# Altium project openbook.PrjPCB (part 3 of 4)

## Sheet p07_ddr3_memory.SchDoc
size 386 x 246 mm
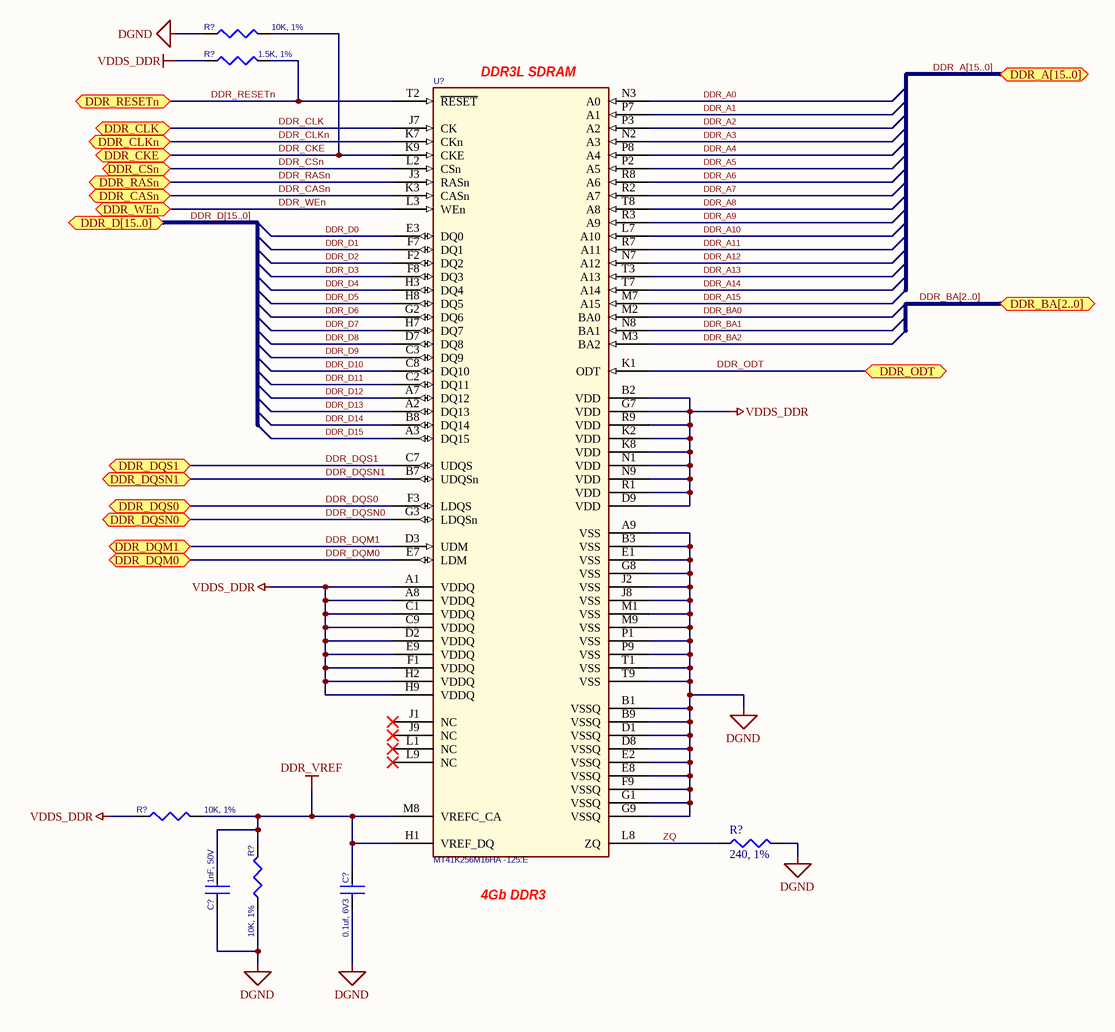
[diagram p7: p07_ddr3_memory.SchDoc]

### Parts
(Parts that share a designator on the sheet are numbered #1, #2 ... from top to bottom, then left to right.)
C?#108  1nF, 50V  [402]
C?#109  0.1uf, 6V3  [402]
R?#78  10K, 1%  [402]
R?#79  1.5K, 1%  [402]
R?#80  10K, 1%  [402]
R?#81  240, 1%  [402]
R?#82  10K, 1%  [402]
U?#16  MT41K256M16HA -125:E  [BGA96_T9_P8_9X14]

### Ports
DDR_A[15..0], DDR_BA[2..0], DDR_CASn, DDR_CKE, DDR_CLK, DDR_CLKn, DDR_CSn, DDR_D[15..0], DDR_DQM0, DDR_DQM1, DDR_DQS0, DDR_DQS1, DDR_DQSN0, DDR_DQSN1, DDR_ODT, DDR_RASn, DDR_RESETn, DDR_WEn

### Nets
DDR_VREF: C?#108.1 C?#109.1 R?#80.2 R?#82.2 U?#16.H1(VREF_DQ) U?#16.M8(VREFC_CA)
DGND: C?#108.2 C?#109.2 R?#78.1 R?#81.2 R?#82.1 U?#16.A9(VSS) U?#16.B1(VSSQ) U?#16.B3(VSS) U?#16.B9(VSSQ) U?#16.D1(VSSQ) U?#16.D8(VSSQ) U?#16.E1(VSS) U?#16.E2(VSSQ) U?#16.E8(VSSQ) U?#16.F9(VSSQ) U?#16.G1(VSSQ) U?#16.G8(VSS) U?#16.G9(VSSQ) U?#16.J2(VSS) U?#16.J8(VSS) U?#16.M1(VSS) U?#16.M9(VSS) U?#16.P1(VSS) U?#16.P9(VSS) U?#16.T1(VSS) U?#16.T9(VSS)
VDDS_DDR: R?#79.1 R?#80.1 U?#16.A1(VDDQ) U?#16.A8(VDDQ) U?#16.B2(VDD) U?#16.C1(VDDQ) U?#16.C9(VDDQ) U?#16.D2(VDDQ) U?#16.D9(VDD) U?#16.E9(VDDQ) U?#16.F1(VDDQ) U?#16.G7(VDD) U?#16.H2(VDDQ) U?#16.H9(VDDQ) U?#16.K2(VDD) U?#16.K8(VDD) U?#16.N1(VDD) U?#16.N9(VDD) U?#16.R1(VDD) U?#16.R9(VDD)
DDR_A0: U?#16.N3(A0)
DDR_A1: U?#16.P7(A1)
DDR_A2: U?#16.P3(A2)
DDR_A3: U?#16.N2(A3)
DDR_A4: U?#16.P8(A4)
DDR_A5: U?#16.P2(A5)
DDR_A6: U?#16.R8(A6)
DDR_A7: U?#16.R2(A7)
DDR_A8: U?#16.T8(A8)
DDR_A9: U?#16.R3(A9)
DDR_A10: U?#16.L7(A10)
DDR_A11: U?#16.R7(A11)
DDR_A12: U?#16.N7(A12)
DDR_A13: U?#16.T3(A13)
DDR_A14: U?#16.T7(A14)
DDR_A15: U?#16.M7(A15)
DDR_BA0: U?#16.M2(BA0)
DDR_BA1: U?#16.N8(BA1)
DDR_BA2: U?#16.M3(BA2)
DDR_CASn: U?#16.K3(CASn) ; port DDR_CASn
DDR_CKE: R?#78.2 U?#16.K9(CKE) ; port DDR_CKE
DDR_CLK: U?#16.J7(CK) ; port DDR_CLK
DDR_CLKn: U?#16.K7(CKn) ; port DDR_CLKn
DDR_CSn: U?#16.L2(CSn) ; port DDR_CSn
DDR_D0: U?#16.E3(DQ0)
DDR_D1: U?#16.F7(DQ1)
DDR_D2: U?#16.F2(DQ2)
DDR_D3: U?#16.F8(DQ3)
DDR_D4: U?#16.H3(DQ4)
DDR_D5: U?#16.H8(DQ5)
DDR_D6: U?#16.G2(DQ6)
DDR_D7: U?#16.H7(DQ7)
DDR_D8: U?#16.D7(DQ8)
DDR_D9: U?#16.C3(DQ9)
DDR_D10: U?#16.C8(DQ10)
DDR_D11: U?#16.C2(DQ11)
DDR_D12: U?#16.A7(DQ12)
DDR_D13: U?#16.A2(DQ13)
DDR_D14: U?#16.B8(DQ14)
DDR_D15: U?#16.A3(DQ15)
DDR_DQM0: U?#16.E7(LDM) ; port DDR_DQM0
DDR_DQM1: U?#16.D3(UDM) ; port DDR_DQM1
DDR_DQS0: U?#16.F3(LDQS) ; port DDR_DQS0
DDR_DQS1: U?#16.C7(UDQS) ; port DDR_DQS1
DDR_DQSN0: U?#16.G3(LDQSn) ; port DDR_DQSN0
DDR_DQSN1: U?#16.B7(UDQSn) ; port DDR_DQSN1
DDR_ODT: U?#16.K1(ODT) ; port DDR_ODT
DDR_RASn: U?#16.J3(RASn) ; port DDR_RASn
DDR_RESETn: R?#79.2 U?#16.T2(~{RESET}) ; port DDR_RESETn
DDR_WEn: U?#16.L3(WEn) ; port DDR_WEn
ZQ: R?#81.1 U?#16.L8(ZQ)

Not connected (* = marked no-connect by the designer): U?#16 J1(NC)* J9(NC)* L1(NC)* L9(NC)*

### Buses and harness runs
bus DDR_A[15..0] = port DDR_A[15..0]
bus DDR_BA[2..0] = port DDR_BA[2..0]
bus DDR_D[15..0] = port DDR_D[15..0]

### Notes on the sheet
- (near U?#16) DDR3L SDRAM
- (near U?#16) 4Gb DDR3

### Library data of the parts
C?#108 = CAP_0.001_X7R_50V_5%_0402: CAP CER 1000PF 16V 10% X7R 0402; Manufacturer: Yageo; Manufacturer Part Number: CC0402KRX7R7BB102; Supplier 1: Digi-Key; Supplier Part Number 1: 311-1352-6-ND; RoHS: RoHS Compliant; Category: Capacitors; Stock 1: 394472; Pricing 1: 1=0.1, 10=0.012, 25=0.0088, 100=0.0057, 250=0.00464, 500=0.00396, 1000=0.00309, 2500=0.00278, 5000=0.00258 (USD); Capacitance: 1000pF; Voltage - Rated: 16V; Tolerance: ±10%; Temperature Coefficient: X7R; Mounting Type: Surface Mount, MLCC; Operating Temperature: -55°C ~ 125°C; Applications: General Purpose; Ratings: -; Package / Case: 0402 (1005 Metric); Size / Dimension: 0.039" L x 0.020" W (1.00mm x 0.50mm); Height - Seated (Max): -; Thickness (Max): 0.022" (0.55mm); Lead Spacing: -; Features: -; Packaging: Digi-Reel®; Lead Style: -; ComponentLink1URL: http://www.yageo.com/documents/recent/UPY-GPHC_X7R_6.3V-to-50V_8.pdf; ComponentLink1Description: http://www.yageo.com/documents/recent/UPY-GPHC_X7R_6.3V-to-50V_8.pdf
C?#109 = CAP_0.1uF_X7R_16V_10% 0402: CAP CER 0.1UF 6.3V 10% X5R 0402; Manufacturer: TDK Corporation; Manufacturer Part Number: C1005X5R0J104K050BA; Capacitance: 0.1µF; Applications: General Purpose; Category: Capacitors; ComponentLink1Description: http://www.kemet.com/datasheets&C0402C104K4RACTU; ComponentLink1URL: http://www.kemet.com/datasheets&C0402C104K4RACTU; Features: -; Height - Seated (Max): -; Lead Spacing: -; Lead Style: -; Mounting Type: Surface Mount, MLCC; Operating Temperature: -55°C ~ 85°C; Package / Case: 0402 (1005 Metric); Packaging: Digi-Reel®; Pricing 1: 1=0.1, 10=0.026, 100=0.0121, 250=0.00992, 500=0.00848, 1000=0.0066, 5000=0.0055 (USD); Ratings: -; RoHS: RoHS Compliant; Size / Dimension: 0.039" L x 0.020" W (1.00mm x 0.50mm); Stock 1: 127604; Supplier 1: Digi-Key; Supplier Part Number 1: 445-1266-6-ND; Temperature Coefficient: X5R; Thickness (Max): 0.022" (0.55mm); Tolerance: ±10%; Voltage - Rated: 6.3V
R?#78 R?#80 R?#82 = RES_10K_1/16W_1%_0402: RES 10K OHM 1/16W 5% 0402 SMD; Manufacturer: Rohm Semiconductor; Manufacturer Part Number: MCR01MZPJ103; Power (Watts): 0.063W, 1/16W; Temperature Coefficient: ±200ppm/°C; Supplier 1: Digi-Key; Supplier Part Number 1: RHM10KJDKR-ND; RoHS: RoHS Compliant; Category: Resistors; Stock 1: 110842; Pricing 1: 1=0.1, 10=0.019, 25=0.014, 100=0.0078, 250=0.00596, 500=0.00476, 1000=0.0035, 5000=0.00251 (USD); Resistance (Ohms): 10k; Composition: Thick Film; Features: Automotive AEC-Q200 Qualified; Tolerance: ±5%; Package / Case: 0402 (1005 Metric); Supplier Device Package: 0402 (1005 Metric); Size / Dimension: 0.039" L x 0.020" W (1.00mm x 0.50mm); Height: 0.016" (0.40mm); Number of Terminations: 2; Packaging: Digi-Reel®; ComponentLink1URL: http://rohmfs.rohm.com/en/products/databook/datasheet/passive/resistor/chip_resistor/mcr_a.pdf; ComponentLink1Description: http://rohmfs.rohm.com/en/products/databook/datasheet/passive/resistor/chip_resistor/mcr_a.pdf
R?#79 = RES_1.5K_1/16W_5%_0402: RES 1.50K OHM 1/16W 1% 0402 SMD; Manufacturer: Yageo; Manufacturer Part Number: RC0402FR-071K5L; Power (Watts): 0.063W, 1/16W; Temperature Coefficient: ±100ppm/°C; Supplier 1: Digi-Key; Supplier Part Number 1: 311-1.50KLRDKR-ND; RoHS: RoHS Compliant; Category: Resistors; Stock 1: 465266; Pricing 1: 1=0.1, 10=0.014, 25=0.0104, 100=0.0063, 250=0.0054, 500=0.00382, 1000=0.0027, 2500=0.00234, 5000=0.00203 (USD); Resistance (Ohms): 1.5k; Composition: Thick Film; Features: -; Tolerance: ±1%; Package / Case: 0402 (1005 Metric); Supplier Device Package: 0402; Size / Dimension: 0.039" L x 0.020" W (1.00mm x 0.50mm); Height: 0.016" (0.40mm); Number of Terminations: 2; Packaging: Digi-Reel®; ComponentLink1URL: http://www.yageo.com/documents/recent/PYu-RC0402_51_RoHS_L_6.pdf; ComponentLink1Description: http://www.yageo.com/documents/recent/PYu-RC0402_51_RoHS_L_6.pdf
R?#81 = RES_240_1/10W_1%_0402: RES 240 OHM 1/10W 1% 0402; Manufacturer: Yageo; Manufacturer Part Number: RC0402FR-07240RL; Resistance (Ohms): 240; Power (Watts): 0.063W, 1/16W; Temperature Coefficient: ±100ppm/°C; Supplier 1: Digi-Key; RoHS: RoHS Compliant; Category: Resistors; Stock 1: 80881; Pricing 1: 1=0.1, 10=0.014, 25=0.0104, 100=0.0063, 250=0.0054, 500=0.00382, 1000=0.0027, 2500=0.00234, 5000=0.00203 (USD); Packaging: Cut Tape (CT); Tolerance: ±1%; Composition: Thick Film; Features: -; Package / Case: 0402 (1005 Metric); Supplier Device Package: 0402; Size / Dimension: 0.039" L x 0.020" W (1.00mm x 0.50mm); Height: 0.016" (0.40mm); Number of Terminations: 2; ComponentLink1URL: http://www.yageo.com/documents/recent/PYu-RC0402_51_RoHS_L_6.pdf; ComponentLink1Description: http://www.yageo.com/documents/recent/PYu-RC0402_51_RoHS_L_6.pdf; Supplier Part Number 1: 311-240LRCT-ND
U?#16 = MT41K256M16HA: DDR2 SDRAM 2Gb (256Mx8); Manufacturer: Micron Technology; Lead Time: 0 weeks; Peak Solder Temperature: 260 deg C; Supplier 1: Arrow; Supplier Part Number 1: 52128708S9959891N2406; Manufacturer Part Number: MT41K256M16HA-125:E; RoHS: CHINA ROHS: Compliant / EU ROHS: Compliant; Stock 1: 0; Pricing 1: 0=10.09 (USD); Package Quantity: 1; Termination Finish: Sn/Ag/Cu; China ROHS Lead (X -> above / O -> below threshold): O; China ROHS Mercury (X -> above / O -> below threshold): O; China ROHS Cadmium (X -> above / O -> below threshold): O; China ROHS Hex Chromium (X -> above / O -> below threshold): O; China ROHS PBB (X -> above / O -> below threshold): O; China ROHS PBDE (X -> above / O -> below threshold): O; EU_ROHS_PROD_EXEMPTION_BY_SUPP: N/R; ComponentLink1URL: http://components.arrow.com/partservice/dataview/altium/52128708S9959891N2406?apiKey=aa438727d59eed98c4bed826d8d949c84cb5e685b92bf87346a0226bd2658797; ComponentLink1Description: http://components.arrow.com/partservice/dataview/altium/52128708S9959891N2406?apiKey=aa438727d59eed98c4bed826d8d949c84cb5e685b92bf87346a0226bd2658797

## Sheet p08_eMMC.SchDoc
size 386 x 246 mm
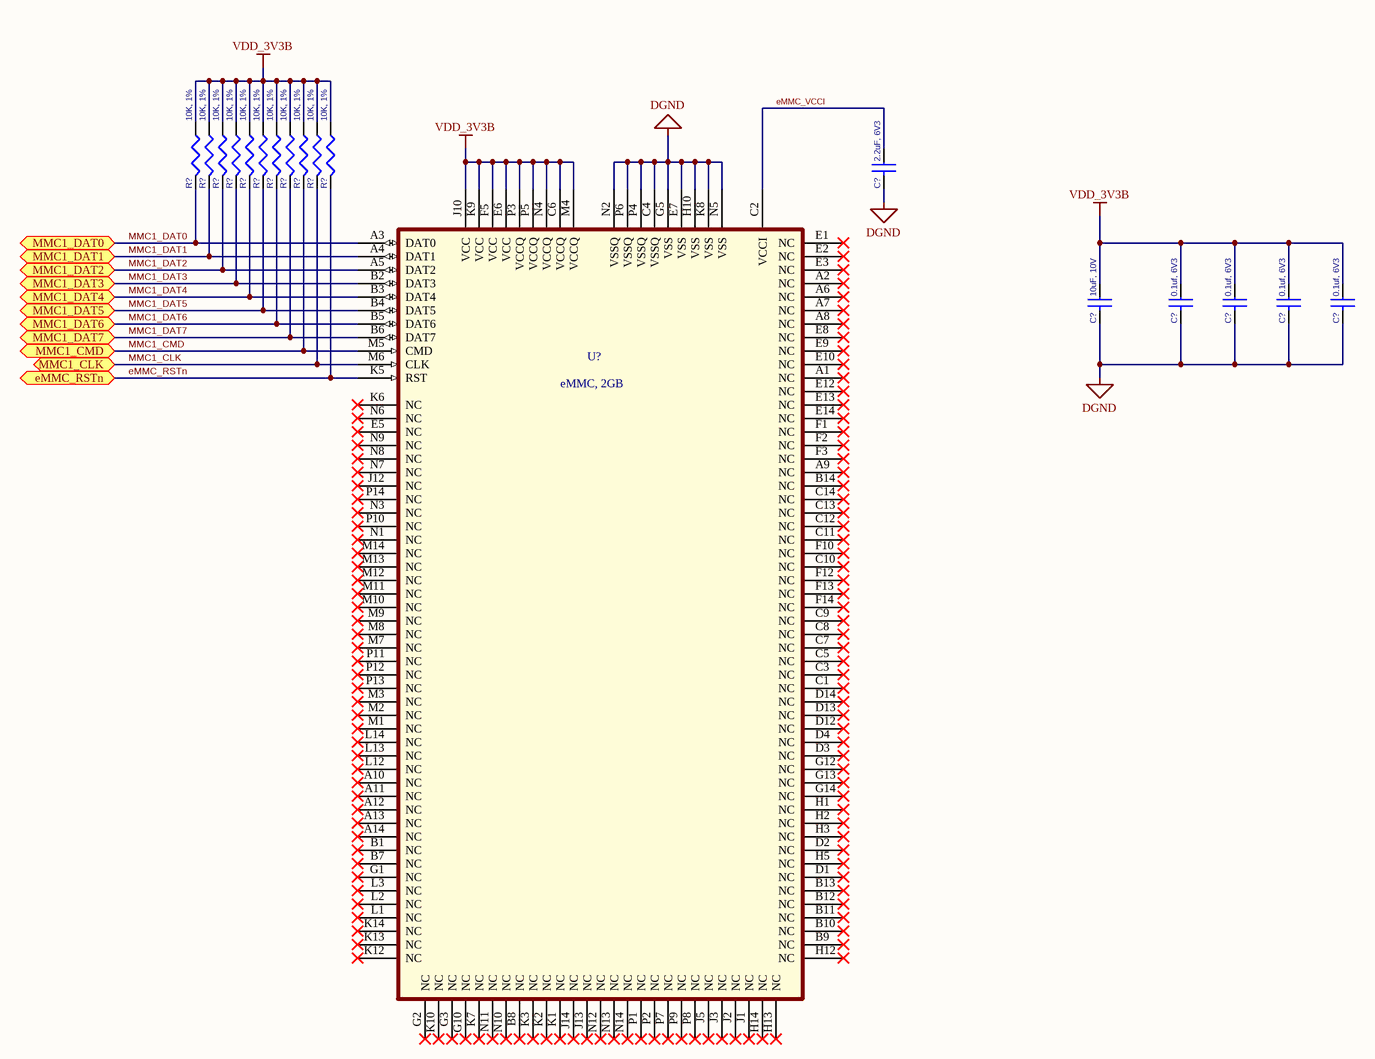
[diagram p8: p08_eMMC.SchDoc]

### Parts
(Parts that share a designator on the sheet are numbered #1, #2 ... from top to bottom, then left to right.)
C?#110  2.2uF, 6V3  [402]
C?#111  10uF, 10V  [805]
C?#112  0.1uf, 6V3  [402]
C?#113  0.1uf, 6V3  [402]
C?#114  0.1uf, 6V3  [402]
C?#115  0.1uf, 6V3  [402]
R?#83  10K, 1%  [402]
R?#84  10K, 1%  [402]
R?#85  10K, 1%  [402]
R?#86  10K, 1%  [402]
R?#87  10K, 1%  [402]
R?#88  10K, 1%  [402]
R?#89  10K, 1%  [402]
R?#90  10K, 1%  [402]
R?#91  10K, 1%  [402]
R?#92  10K, 1%  [402]
R?#93  10K, 1%  [402]
U?#17  eMMC, 2GB  [BGA153_P14_P5_11P5X13]

### Ports
eMMC_RSTn, MMC1_CLK, MMC1_CMD, MMC1_DAT0, MMC1_DAT1, MMC1_DAT2, MMC1_DAT3, MMC1_DAT4, MMC1_DAT5, MMC1_DAT6, MMC1_DAT7

### Nets
DGND: C?#110.2 C?#111.2 C?#112.2 C?#113.2 C?#114.2 C?#115.2 U?#17.C4(VSSQ) U?#17.E7(VSS) U?#17.G5(VSS) U?#17.H10(VSS) U?#17.K8(VSS) U?#17.N2(VSSQ) U?#17.N5(VSS) U?#17.P4(VSSQ) U?#17.P6(VSSQ)
VDD_3V3B: C?#111.1 C?#112.1 C?#113.1 C?#114.1 C?#115.1 R?#83.1 R?#84.1 R?#85.1 R?#86.1 R?#87.1 R?#88.1 R?#89.1 R?#90.1 R?#91.1 R?#92.1 R?#93.1 U?#17.C6(VCCQ) U?#17.E6(VCC) U?#17.F5(VCC) U?#17.J10(VCC) U?#17.K9(VCC) U?#17.M4(VCCQ) U?#17.N4(VCCQ) U?#17.P3(VCCQ) U?#17.P5(VCCQ)
eMMC_RSTn: R?#93.2 U?#17.K5(RST) ; port eMMC_RSTn
eMMC_VCCI: C?#110.1 U?#17.C2(VCCI)
MMC1_CLK: R?#92.2 U?#17.M6(CLK) ; port MMC1_CLK
MMC1_CMD: R?#91.2 U?#17.M5(CMD) ; port MMC1_CMD
MMC1_DAT0: R?#83.2 U?#17.A3(DAT0) ; port MMC1_DAT0
MMC1_DAT1: R?#84.2 U?#17.A4(DAT1) ; port MMC1_DAT1  [project net EHRPWM1A]
MMC1_DAT2: R?#85.2 U?#17.A5(DAT2) ; port MMC1_DAT2  [project net EHRPWM1B]
MMC1_DAT3: R?#86.2 U?#17.B2(DAT3) ; port MMC1_DAT3
MMC1_DAT4: R?#87.2 U?#17.B3(DAT4) ; port MMC1_DAT4
MMC1_DAT5: R?#88.2 U?#17.B4(DAT5) ; port MMC1_DAT5
MMC1_DAT6: R?#89.2 U?#17.B5(DAT6) ; port MMC1_DAT6
MMC1_DAT7: R?#90.2 U?#17.B6(DAT7) ; port MMC1_DAT7

Not connected (* = marked no-connect by the designer): U?#17 A1(NC)* A2(NC)* A6(NC)* A7(NC)* A8(NC)* A9(NC)* A10(NC)* A11(NC)* A12(NC)* A13(NC)* A14(NC)* B1(NC)* B7(NC)* B8(NC)* B9(NC)* B10(NC)* B11(NC)* B12(NC)* B13(NC)* B14(NC)* C1(NC)* C3(NC)* C5(NC)* C7(NC)* C8(NC)* C9(NC)* C10(NC)* C11(NC)* C12(NC)* C13(NC)* C14(NC)* D1(NC)* D2(NC)* D3(NC)* D4(NC)* D12(NC)* D13(NC)* D14(NC)* E1(NC)* E2(NC)* E3(NC)* E5(NC)* E8(NC)* E9(NC)* E10(NC)* E12(NC)* E13(NC)* E14(NC)* F1(NC)* F2(NC)* F3(NC)* F10(NC)* F12(NC)* F13(NC)* F14(NC)* G1(NC)* G2(NC)* G3(NC)* G10(NC)* G12(NC)* G13(NC)* G14(NC)* H1(NC)* H2(NC)* H3(NC)* H5(NC)* H12(NC)* H13(NC)* H14(NC)* J1(NC)* J2(NC)* J3(NC)* J5(NC)* J12(NC)* J13(NC)* J14(NC)* K1(NC)* K2(NC)* K3(NC)* K6(NC)* K7(NC)* K10(NC)* K12(NC)* K13(NC)* K14(NC)* L1(NC)* L2(NC)* L3(NC)* L12(NC)* L13(NC)* L14(NC)* M1(NC)* M2(NC)* M3(NC)* M7(NC)* M8(NC)* M9(NC)* M10(NC)* M11(NC)* M12(NC)* M13(NC)* M14(NC)* N1(NC)* N3(NC)* N6(NC)* N7(NC)* N8(NC)* N9(NC)* N10(NC)* N11(NC)* N12(NC)* N13(NC)* N14(NC)* P1(NC)* P2(NC)* P7(NC)* P8(NC)* P9(NC)* P10(NC)* P11(NC)* P12(NC)* P13(NC)* P14(NC)*

### Library data of the parts
C?#110 = CAP_2.2uF_X5R_6.3V_10%_0402: CAP CER 2.2UF 6.3V 10% X5R 0402; Manufacturer: TDK Corporation; Manufacturer Part Number: C1005X5R0J225K050BC; Capacitance: 2.2µF; Supplier 1: Digi-Key; Supplier Part Number 1: 445-6847-6-ND; RoHS: RoHS Compliant; Category: Capacitors; Stock 1: 47221; Pricing 1: 1=0.24, 10=0.2, 100=0.1, 250=0.075, 500=0.06626, 1000=0.05875, 5000=0.04875 (USD); Voltage - Rated: 6.3V; Tolerance: ±10%; Temperature Coefficient: X5R; Mounting Type: Surface Mount, MLCC; Operating Temperature: -55°C ~ 85°C; Applications: General Purpose; Ratings: -; Package / Case: 0402 (1005 Metric); Size / Dimension: 0.039" L x 0.020" W (1.00mm x 0.50mm); Height - Seated (Max): -; Thickness (Max): 0.022" (0.55mm); Lead Spacing: -; Features: -; Packaging: Digi-Reel®; Lead Style: -; ComponentLink1URL: http://product.tdk.com/capacitor/mlcc/en/documents/mlcc_commercial_general_en.pdf; ComponentLink1Description: http://product.tdk.com/capacitor/mlcc/en/documents/mlcc_commercial_general_en.pdf
C?#111 = CAP_10uF_Y5V_10V_10%_0805: CAP CER 10UF 10V Y5V 0805; Manufacturer: TDK Corporation; Manufacturer Part Number: C2012Y5V1A106Z; Capacitance: 10µF; Tolerance: -20%, +80%; Temperature Coefficient: Y5V (F); Supplier 1: Digi-Key; Supplier Part Number 1: 445-1371-6-ND; RoHS: RoHS Compliant; Category: Capacitors; Stock 1: 123307; Pricing 1: 1=0.15, 10=0.105, 100=0.0499, 250=0.042, 500=0.03518, 1000=0.02887 (USD); Voltage - Rated: 10V; Mounting Type: Surface Mount, MLCC; Operating Temperature: -30°C ~ 85°C; Applications: General Purpose; Ratings: -; Package / Case: 0805 (2012 Metric); Size / Dimension: 0.079" L x 0.049" W (2.00mm x 1.25mm); Height - Seated (Max): -; Thickness (Max): 0.057" (1.45mm); Lead Spacing: -; Features: -; Packaging: Digi-Reel®; Lead Style: -; ComponentLink1URL: http://media.digikey.com/pdf/Data%20Sheets/TDK%20PDFs/C_Series_GeneralAppl_B11.pdf; ComponentLink1Description: http://media.digikey.com/pdf/Data%20Sheets/TDK%20PDFs/C_Series_GeneralAppl_B11.pdf
C?#112-C?#115 = CAP_0.1uF_X7R_16V_10% 0402: as C?#109 on sheet p07_ddr3_memory; Applications: General Purpose; Category: Capacitors; ComponentLink1Description: http://www.kemet.com/datasheets&C0402C104K4RACTU; ComponentLink1URL: http://www.kemet.com/datasheets&C0402C104K4RACTU; Features: -; Height - Seated (Max): -; Lead Spacing: -; Lead Style: -; Mounting Type: Surface Mount, MLCC; Operating Temperature: -55°C ~ 85°C; Package / Case: 0402 (1005 Metric); Packaging: Digi-Reel®; Pricing 1: 1=0.1, 10=0.026, 100=0.0121, 250=0.00992, 500=0.00848, 1000=0.0066, 5000=0.0055 (USD); Ratings: -; RoHS: RoHS Compliant; Size / Dimension: 0.039" L x 0.020" W (1.00mm x 0.50mm); Stock 1: 127604; Supplier 1: Digi-Key; Supplier Part Number 1: 445-1266-6-ND; Temperature Coefficient: X5R; Thickness (Max): 0.022" (0.55mm); Tolerance: ±10%; Voltage - Rated: 6.3V
R?#83-R?#93 = RES_10K_1/16W_1%_0402: as R?#78 on sheet p07_ddr3_memory; Supplier 1: Digi-Key; Supplier Part Number 1: RHM10KJDKR-ND; RoHS: RoHS Compliant; Category: Resistors; Stock 1: 110842; Pricing 1: 1=0.1, 10=0.019, 25=0.014, 100=0.0078, 250=0.00596, 500=0.00476, 1000=0.0035, 5000=0.00251 (USD); Resistance (Ohms): 10k; Composition: Thick Film; Features: Automotive AEC-Q200 Qualified; Tolerance: ±5%; Package / Case: 0402 (1005 Metric); Supplier Device Package: 0402 (1005 Metric); Size / Dimension: 0.039" L x 0.020" W (1.00mm x 0.50mm); Height: 0.016" (0.40mm); Number of Terminations: 2; Packaging: Digi-Reel®; ComponentLink1URL: http://rohmfs.rohm.com/en/products/databook/datasheet/passive/resistor/chip_resistor/mcr_a.pdf; ComponentLink1Description: http://rohmfs.rohm.com/en/products/databook/datasheet/passive/resistor/chip_resistor/mcr_a.pdf
U?#17 = eMMC: Flash Card 2G-byte 3.3V MultiMedia Card 153-Pin WFBGA; Manufacturer: Micron Technology; Manufacturer Part Number: MTFC2GMVEA-0M WT; Lead Time: 2 weeks; Supplier 1: Arrow; Supplier Part Number 1: 53710993S251949N2406; RoHS: CHINA ROHS: Compliant / EU ROHS: Compliant; Stock 1: 1009; Pricing 1: 0=7.21 (USD); Package Quantity: 1; EU_ROHS_PROD_EXEMPTION_BY_SUPP: N/R; ComponentLink1URL: http://components.arrow.com/partservice/dataview/altium/53710993S251949N2406?apiKey=aa438727d59eed98c4bed826d8d949c84cb5e685b92bf87346a0226bd2658797; ComponentLink1Description: http://components.arrow.com/partservice/dataview/altium/53710993S251949N2406?apiKey=aa438727d59eed98c4bed826d8d949c84cb5e685b92bf87346a0226bd2658797

## Sheet p09_ethernet.SchDoc
size 386 x 246 mm
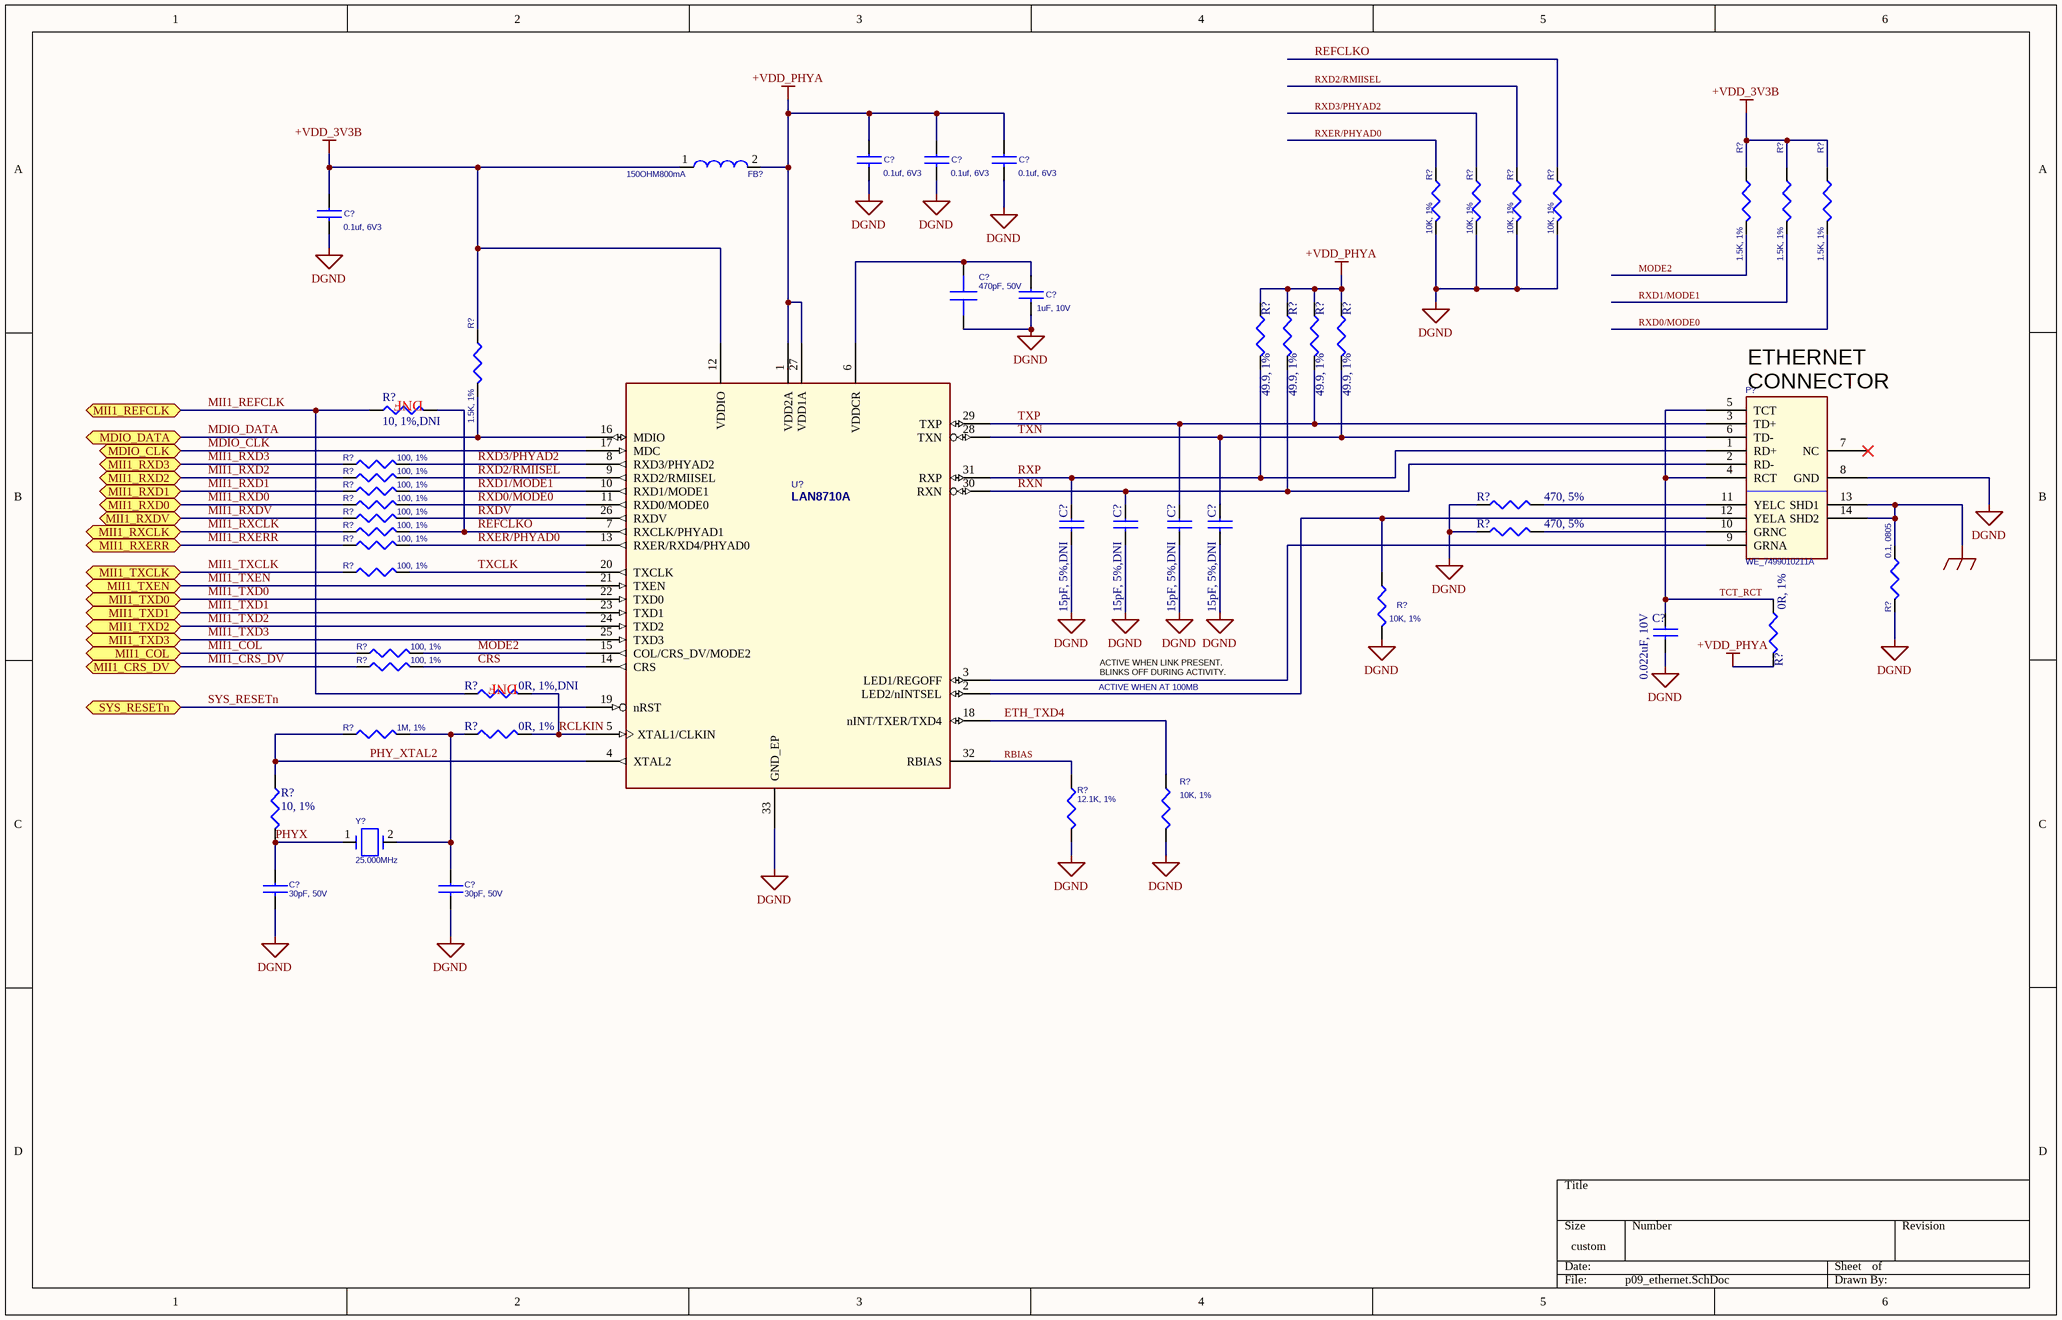
[diagram p9: p09_ethernet.SchDoc]

### Parts
(Parts that share a designator on the sheet are numbered #1, #2 ... from top to bottom, then left to right.)
C?#116  0.1uf, 6V3  [402]
C?#117  0.1uf, 6V3  [402]
C?#118  0.1uf, 6V3  [402]
C?#119  0.1uf, 6V3  [402]
C?#120  470pF, 50V  [402]
C?#121  1uF, 10V  [402]
C?#122  15pF, 5%,DNI  [402]
C?#123  15pF, 5%,DNI  [402]
C?#124  15pF, 5%,DNI  [402]
C?#125  15pF, 5%,DNI  [402]
C?#126  0.022uF, 10V  [402]
C?#127  30pF, 50V  [402]
C?#128  30pF, 50V  [402]
FB?#7  150OHM800mA  [SM-7351-IND-0805]
P?#8  WE_7499010211A  [RJ45-7499010211A]
R?#94  10K, 1%  [402]
R?#95  10K, 1%  [402]
R?#96  10K, 1%  [402]
R?#97  10K, 1%  [402]
R?#98  1.5K, 1%  [402]
R?#99  1.5K, 1%  [402]
R?#100  1.5K, 1%  [402]
R?#101  49.9, 1%  [402]
R?#102  49.9, 1%  [402]
R?#103  49.9, 1%  [402]
R?#104  49.9, 1%  [402]
R?#105  1.5K, 1%  [402]
R?#106  10, 1%,DNI  [402]
R?#107  100, 1%  [402]
R?#108  100, 1%  [402]
R?#109  100, 1%  [402]
R?#110  100, 1%  [402]
R?#111  100, 1%  [402]
R?#112  470, 5%  [402]
R?#113  100, 1%  [402]
R?#114  100, 1%  [402]
R?#115  470, 5%  [402]
R?#116  0.1, 0805  [805]
R?#117  100, 1%  [402]
R?#118  10K, 1%  [402]
R?#119  0R, 1%  [402]
R?#120  100, 1%  [402]
R?#121  100, 1%  [402]
R?#122  0R, 1%,DNI  [402]
R?#123  1M, 1%  [402]
R?#124  0R, 1%  [402]
R?#125  10, 1%  [402]
R?#126  12.1K, 1%  [402]
R?#127  10K, 1%  [402]
U?#18  LAN8710A  [QFN32_5X5MM_EP3P3MM]
Y?#4  25.000MHz  [XTAL150SMD_125X196]

### Ports
MDIO_CLK, MDIO_DATA, MII1_COL, MII1_CRS_DV, MII1_REFCLK, MII1_RXCLK, MII1_RXD0, MII1_RXD1, MII1_RXD2, MII1_RXD3, MII1_RXDV, MII1_RXERR, MII1_TXCLK, MII1_TXD0, MII1_TXD1, MII1_TXD2, MII1_TXD3, MII1_TXEN, SYS_RESETn

### Nets
+VDD_3V3B: C?#119.1 FB?#7.1 R?#98.1 R?#99.1 R?#100.1 R?#105.1 U?#18.12(VDDIO)
+VDD_PHYA: C?#116.1 C?#117.1 C?#118.1 FB?#7.2 R?#101.1 R?#102.1 R?#103.1 R?#104.1 R?#119.2 U?#18.1(VDD2A) U?#18.27(VDD1A)
DGND: C?#116.2 C?#117.2 C?#118.2 C?#119.2 C?#120.2 C?#121.2 C?#122.2 C?#123.2 C?#124.2 C?#125.2 C?#126.2 C?#127.2 C?#128.2 P?#8.8(GND) R?#94.2 R?#95.2 R?#96.2 R?#97.2 R?#112.1 R?#115.1 R?#116.2 R?#118.2 R?#126.2 R?#127.2 U?#18.33(GND_EP)
GND_EARTH: P?#8.13(SHD1) P?#8.14(SHD2) R?#116.1
CRS: R?#121.2 U?#18.14(CRS)
ETH_TXD4: R?#127.1 U?#18.18(nINT/TXER/TXD4)
MDIO_CLK: U?#18.17(MDC) ; port MDIO_CLK
MDIO_DATA: R?#105.2 U?#18.16(MDIO) ; port MDIO_DATA
MII1_COL: R?#120.1 ; port MII1_COL
MII1_CRS_DV: R?#121.1 ; port MII1_CRS_DV
MII1_REFCLK: R?#106.1 R?#122.1 ; port MII1_REFCLK
MII1_RXCLK: R?#113.1 ; port MII1_RXCLK
MII1_RXD0: R?#110.1 ; port MII1_RXD0
MII1_RXD1: R?#109.1 ; port MII1_RXD1
MII1_RXD2: R?#108.1 ; port MII1_RXD2
MII1_RXD3: R?#107.1 ; port MII1_RXD3
MII1_RXDV: R?#111.1 ; port MII1_RXDV
MII1_RXERR: R?#114.1 ; port MII1_RXERR
MII1_TXCLK: R?#117.1 ; port MII1_TXCLK
MII1_TXD0: U?#18.22(TXD0) ; port MII1_TXD0
MII1_TXD1: U?#18.23(TXD1) ; port MII1_TXD1
MII1_TXD2: U?#18.24(TXD2) ; port MII1_TXD2
MII1_TXD3: U?#18.25(TXD3) ; port MII1_TXD3
MII1_TXEN: U?#18.21(TXEN) ; port MII1_TXEN
MODE2: R?#98.2 R?#120.2 U?#18.15(COL/CRS_DV/MODE2)
PHY_XTAL2: R?#123.1 R?#125.1 U?#18.4(XTAL2)
PHYX: C?#127.1 R?#125.2 Y?#4.1
RBIAS: R?#126.1 U?#18.32(RBIAS)
RCLKIN: R?#122.2 R?#124.2 U?#18.5(XTAL1/CLKIN)
REFCLKO: R?#97.1 R?#106.2 R?#113.2 U?#18.7(RXCLK/PHYAD1)
RXD0/MODE0: R?#100.2 R?#110.2 U?#18.11(RXD0/MODE0)
RXD1/MODE1: R?#99.2 R?#109.2 U?#18.10(RXD1/MODE1)
RXD2/RMIISEL: R?#96.1 R?#108.2 U?#18.9(RXD2/RMIISEL)
RXD3/PHYAD2: R?#95.1 R?#107.2 U?#18.8(RXD3/PHYAD2)
RXDV: R?#111.2 U?#18.26(RXDV)
RXER/PHYAD0: R?#94.1 R?#114.2 U?#18.13(RXER/RXD4/PHYAD0)
RXN: C?#123.1 P?#8.2(RD-) R?#102.2 U?#18.30(RXN)
RXP: C?#122.1 P?#8.1(RD+) R?#101.2 U?#18.31(RXP)
SYS_RESETn: U?#18.19(nRST) ; port SYS_RESETn
TCT_RCT: C?#126.1 P?#8.4(RCT) P?#8.5(TCT) R?#119.1
TXCLK: R?#117.2 U?#18.20(TXCLK)
TXN: C?#125.1 P?#8.6(TD-) R?#104.2 U?#18.28(TXN)
TXP: C?#124.1 P?#8.3(TD+) R?#103.2 U?#18.29(TXP)
NetC?#120_1: C?#120.1 C?#121.1 U?#18.6(VDDCR)
NetC?#128_1: C?#128.1 R?#123.2 R?#124.1 Y?#4.2
NetP?#8_9: P?#8.9(GRNA) U?#18.3(LED1/REGOFF)
NetP?#8_10: P?#8.10(GRNC) R?#115.2
NetP?#8_11: P?#8.11(YELC) R?#112.2
NetP?#8_12: P?#8.12(YELA) R?#118.1 U?#18.2(LED2/nINTSEL)

Not connected (* = marked no-connect by the designer): P?#8 7(NC)*

### Notes on the sheet
- (near R?#106) DNF
- (near P?#8) ETHERNET
  CONNECTOR
- (near R?#122) DNF
- ACTIVE WHEN LINK PRESENT.
  BLINKS OFF DURING ACTIVITY.
- ACTIVE WHEN AT 100MB

### Library data of the parts
C?#116-C?#119 = CAP_0.1uF_X7R_16V_10% 0402: as C?#109 on sheet p07_ddr3_memory; Applications: General Purpose; Category: Capacitors; ComponentLink1Description: http://www.kemet.com/datasheets&C0402C104K4RACTU; ComponentLink1URL: http://www.kemet.com/datasheets&C0402C104K4RACTU; Features: -; Height - Seated (Max): -; Lead Spacing: -; Lead Style: -; Mounting Type: Surface Mount, MLCC; Operating Temperature: -55°C ~ 85°C; Package / Case: 0402 (1005 Metric); Packaging: Digi-Reel®; Pricing 1: 1=0.1, 10=0.026, 100=0.0121, 250=0.00992, 500=0.00848, 1000=0.0066, 5000=0.0055 (USD); Ratings: -; RoHS: RoHS Compliant; Size / Dimension: 0.039" L x 0.020" W (1.00mm x 0.50mm); Stock 1: 127604; Supplier 1: Digi-Key; Supplier Part Number 1: 445-1266-6-ND; Temperature Coefficient: X5R; Thickness (Max): 0.022" (0.55mm); Tolerance: ±10%; Voltage - Rated: 6.3V
C?#120 = 470pF/5%/50V/C0G/0603_0: CAP CER 470PF 50V 10% X7R 0402; Manufacturer: Murata Electronics North America; Manufacturer Part Number: GRM155R71H471KA01D; Supplier 1: Digi-Key; Supplier Part Number 1: 490-1300-6-ND; RoHS: RoHS Compliant; Category: Capacitors; Stock 1: 211618; Pricing 1: 1=0.1, 10=0.025, 50=0.0136, 100=0.0116, 250=0.00944, 500=0.00808, 1000=0.0063, 5000=0.00525 (USD); Capacitance: 470pF; Voltage - Rated: 50V; Tolerance: ±10%; Temperature Coefficient: X7R; Mounting Type: Surface Mount, MLCC; Operating Temperature: -55°C ~ 125°C; Applications: General Purpose; Ratings: -; Package / Case: 0402 (1005 Metric); Size / Dimension: 0.039" L x 0.020" W (1.00mm x 0.50mm); Height - Seated (Max): -; Thickness (Max): 0.022" (0.55mm); Lead Spacing: -; Features: -; Packaging: Digi-Reel®; Lead Style: -; ComponentLink1URL: http://psearch.murata.com/capacitor/product/GRM155R71H471KA01#.pdf; ComponentLink1Description: http://psearch.murata.com/capacitor/product/GRM155R71H471KA01#.pdf
C?#121 = CAP_1.0UF_X5R_10V_10%_0402: CAP CER 1UF 10V 10% X5R 0402; Manufacturer: AVX Corporation; Manufacturer Part Number: 0402ZD105KAT2A; Capacitance: 1.0µF; Applications: General Purpose; Category: Capacitors; ComponentLink1Description: http://www.avx.com/docs/Catalogs/cx5r.pdf; ComponentLink1URL: http://www.avx.com/docs/Catalogs/cx5r.pdf; Features: -; Height - Seated (Max): -; Lead Spacing: -; Lead Style: -; Mounting Type: Surface Mount, MLCC; Operating Temperature: -55°C ~ 85°C; Package / Case: 0402 (1005 Metric); Packaging: Digi-Reel®; Pricing 1: 1=0.3, 10=0.25, 100=0.125, 250=0.09376, 500=0.08282, 1000=0.07344, 5000=0.06094 (USD); Ratings: -; RoHS: RoHS Compliant; Size / Dimension: 0.039" L x 0.020" W (1.00mm x 0.50mm); Stock 1: 409277; Supplier 1: Digi-Key; Supplier Part Number 1: 478-4596-6-ND; Temperature Coefficient: X5R; Thickness (Max): 0.022" (0.56mm); Tolerance: ±10%; Voltage - Rated: 10V
C?#122-C?#125 = CAP_0402_15pF_50V_5%: CAP CER 15PF 50V 5% NP0 0402; Manufacturer: TDK Corporation; Manufacturer Part Number: C1005C0G1H150J050BA; Temperature Coefficient: C0G, NP0; Supplier 1: Digi-Key; RoHS: RoHS Compliant; Category: Capacitors; Stock 1: 352191; Pricing 1: 1=0.1, 10=0.024, 100=0.011, 250=0.009, 500=0.0077, 1000=0.006, 5000=0.005 (USD); Packaging: Cut Tape (CT); Capacitance: 15pF; Voltage - Rated: 50V; Tolerance: ±5%; Mounting Type: Surface Mount, MLCC; Operating Temperature: -55°C ~ 125°C; Applications: General Purpose; Ratings: -; Package/Case: 0402 (1005 Metric); Size / Dimension: 0.039" L x 0.020" W (1.00mm x 0.50mm); Height - Seated (Max): -; Thickness (Max): 0.022" (0.55mm); Lead Spacing: -; Features: -; Lead Style: -; ComponentLink1URL: http://product.tdk.com/capacitor/mlcc/en/documents/mlcc_commercial_general_en.pdf; ComponentLink1Description: http://product.tdk.com/capacitor/mlcc/en/documents/mlcc_commercial_general_en.pdf; Supplier Part Number 1: 445-1237-1-ND
C?#126 = CAP_0402_0.022uf_X7R_10V: CAP CER 0.022UF 10V 10% X7R 0402; Manufacturer: Taiyo Yuden; Manufacturer Part Number: LMK105B7223KV-F; Capacitance: 0.022µF; Supplier 1: Digi-Key; RoHS: RoHS Compliant; Category: Capacitors; Stock 1: 55454; Pricing 1: 1=0.1, 10=0.013, 50=0.0072, 100=0.0061, 250=0.00496, 500=0.00424, 1000=0.0033, 2500=0.00297, 5000=0.00275 (USD); Packaging: Digi-Reel®; Voltage - Rated: 10V; Tolerance: ±10%; Temperature Coefficient: X7R; Mounting Type: Surface Mount, MLCC; Operating Temperature: -55°C ~ 125°C; Applications: General Purpose; Ratings: -; Package/Case: 0402 (1005 Metric); Size / Dimension: 0.039" L x 0.020" W (1.00mm x 0.50mm); Height - Seated (Max): -; Thickness (Max): 0.022" (0.55mm); Lead Spacing: -; Features: -; Lead Style: -; ComponentLink1URL: http://www.yuden.co.jp/or/product/category/capacitor/LMK105B7223KV-F.pdf; ComponentLink1Description: http://www.yuden.co.jp/or/product/category/capacitor/LMK105B7223KV-F.pdf; Supplier Part Number 1: 587-2476-6-ND
C?#127 C?#128 = CAP_30PF_COG_50V_5%_0402: CAP CER 30PF 50V 5% NP0 0402; Manufacturer: TDK Corporation; Manufacturer Part Number: C1005C0G1H300J; Temperature Coefficient: C0G, NP0; Supplier 1: Digi-Key; Supplier Part Number 1: 445-4902-6-ND; RoHS: RoHS Compliant; Category: Capacitors; Stock 1: 120757; Pricing 1: 1=0.1, 10=0.026, 100=0.0121, 250=0.00992, 500=0.00848, 1000=0.0066, 5000=0.0055 (USD); Capacitance: 30pF; Voltage - Rated: 50V; Tolerance: ±5%; Mounting Type: Surface Mount, MLCC; Operating Temperature: -55°C ~ 125°C; Applications: General Purpose; Ratings: -; Package / Case: 0402 (1005 Metric); Size / Dimension: 0.039" L x 0.020" W (1.00mm x 0.50mm); Height - Seated (Max): -; Thickness (Max): 0.022" (0.55mm); Lead Spacing: -; Features: -; Packaging: Digi-Reel®; Lead Style: -; ComponentLink1URL: http://media.digikey.com/pdf/Data%20Sheets/TDK%20PDFs/C_Series_GeneralAppl_B11.pdf; ComponentLink1Description: http://media.digikey.com/pdf/Data%20Sheets/TDK%20PDFs/C_Series_GeneralAppl_B11.pdf
FB?#7 = FER_180_200_0: FERRITE 800MA 150 OHM 0805 SMD; PartName: FerriteBead150ohm800mA; Mfr: Steward; MfrNum: LI0805H151R-10; TIIntPartnumber: 1L0010; Manufacturer: Laird-Signal Integrity Products; Vendor: Digikey; Impedance @ Frequency: 150 Ohm @ 100MHz; DC Resistance (DCR): 150 mOhm Max; Filter Type: Differential Mode - Single; Supplier 1: Digi-Key; Supplier Part Number 1: 240-2384-6-ND; Manufacturer Part Number: LI0805H151R-10; RoHS: RoHS Compliant; Category: Filters; Stock 1: 3694; Pricing 1: 1=0.1, 10=0.07, 25=0.064, 50=0.0574, 100=0.0421, 250=0.03064, 500=0.02808, 1000=0.02424 (USD); Current Rating: 800mA; Package / Case: 0805 (2012 Metric); Mounting Type: Surface Mount; Packaging: Digi-Reel®; Height (Max): 0.043" (1.10mm); Size / Dimension: 0.079" L x 0.049" W (2.00mm x 1.25mm); ComponentLink1URL: http://www.lairdtech.com/WorkArea/linkit.aspx?LinkIdentifier=id&ItemID=4912; ComponentLink1Description: http://www.lairdtech.com/WorkArea/linkit.aspx?LinkIdentifier=id&ItemID=4912
P?#8 = CONN_RJ45_MAG_WE_0: WE-RJ45 LAN Transformer
R?#94-R?#97 R?#118 R?#127 = RES_10K_1/16W_1%_0402: as R?#78 on sheet p07_ddr3_memory; Supplier 1: Digi-Key; Supplier Part Number 1: RHM10KJDKR-ND; RoHS: RoHS Compliant; Category: Resistors; Stock 1: 110842; Pricing 1: 1=0.1, 10=0.019, 25=0.014, 100=0.0078, 250=0.00596, 500=0.00476, 1000=0.0035, 5000=0.00251 (USD); Resistance (Ohms): 10k; Composition: Thick Film; Features: Automotive AEC-Q200 Qualified; Tolerance: ±5%; Package / Case: 0402 (1005 Metric); Supplier Device Package: 0402 (1005 Metric); Size / Dimension: 0.039" L x 0.020" W (1.00mm x 0.50mm); Height: 0.016" (0.40mm); Number of Terminations: 2; Packaging: Digi-Reel®; ComponentLink1URL: http://rohmfs.rohm.com/en/products/databook/datasheet/passive/resistor/chip_resistor/mcr_a.pdf; ComponentLink1Description: http://rohmfs.rohm.com/en/products/databook/datasheet/passive/resistor/chip_resistor/mcr_a.pdf
R?#98-R?#100 R?#105 = RES_1.5K_1/16W_5%_0402: as R?#79 on sheet p07_ddr3_memory; Supplier 1: Digi-Key; Supplier Part Number 1: 311-1.50KLRDKR-ND; RoHS: RoHS Compliant; Category: Resistors; Stock 1: 465266; Pricing 1: 1=0.1, 10=0.014, 25=0.0104, 100=0.0063, 250=0.0054, 500=0.00382, 1000=0.0027, 2500=0.00234, 5000=0.00203 (USD); Resistance (Ohms): 1.5k; Composition: Thick Film; Features: -; Tolerance: ±1%; Package / Case: 0402 (1005 Metric); Supplier Device Package: 0402; Size / Dimension: 0.039" L x 0.020" W (1.00mm x 0.50mm); Height: 0.016" (0.40mm); Number of Terminations: 2; Packaging: Digi-Reel®; ComponentLink1URL: http://www.yageo.com/documents/recent/PYu-RC0402_51_RoHS_L_6.pdf; ComponentLink1Description: http://www.yageo.com/documents/recent/PYu-RC0402_51_RoHS_L_6.pdf
R?#101-R?#104 = RES_49.9_1/16W_1%_0402: RES 49.9 OHM 1/16W 1% 0402 SMD; Manufacturer: Yageo; Manufacturer Part Number: RC0402FR-0749R9L; Resistance (Ohms): 49.9; Power (Watts): 0.063W, 1/16W; Temperature Coefficient: ±100ppm/°C; Supplier 1: Digi-Key; RoHS: RoHS Compliant; Category: Resistors; Stock 1: 1375322; Pricing 1: 1=0.1, 10=0.014, 25=0.0104, 100=0.0063, 250=0.0054, 500=0.00382, 1000=0.0027, 2500=0.00234, 5000=0.00203 (USD); Packaging: Cut Tape (CT); Tolerance: ±1%; Composition: Thick Film; Features: -; Package / Case: 0402 (1005 Metric); Supplier Device Package: 0402; Size / Dimension: 0.039" L x 0.020" W (1.00mm x 0.50mm); Height: 0.016" (0.40mm); Number of Terminations: 2; ComponentLink1URL: http://www.yageo.com/documents/recent/PYu-RC0402_51_RoHS_L_6.pdf; ComponentLink1Description: http://www.yageo.com/documents/recent/PYu-RC0402_51_RoHS_L_6.pdf; Supplier Part Number 1: 311-49.9LRCT-ND
R?#106 R?#125 = RES_10_1/16W_1%_0402: RES 10 OHM 1/16W 1% 0402 SMD; Manufacturer: Stackpole Electronics Inc; Manufacturer Part Number: RMCF0402FT10R0; Resistance (Ohms): 10; Power (Watts): 0.063W, 1/16W; Temperature Coefficient: ±100ppm/°C; Supplier 1: Digi-Key; RoHS: RoHS Compliant; Category: Resistors; Stock 1: 46670; Pricing 1: 1=0.04, 10=0.025, 50=0.0138, 100=0.0105, 250=0.0078, 500=0.00576, 1000=0.00384, 2500=0.00324, 5000=0.0027 (USD); Packaging: Cut Tape (CT); Tolerance: ±1%; Composition: Thick Film; Features: -; Package/Case: 0402 (1005 Metric); Supplier Device Package: 0402; Size / Dimension: 0.039" L x 0.020" W (1.00mm x 0.50mm); Height: 0.016" (0.40mm); Number of Terminations: 2; ComponentLink1URL: http://www.seielect.com/Catalog/SEI-RMCF_RMCP.pdf; ComponentLink1Description: http://www.seielect.com/Catalog/SEI-RMCF_RMCP.pdf; Supplier Part Number 1: RMCF0402FT10R0CT-ND
R?#107-R?#111 R?#113 R?#114 R?#117 R?#120 R?#121 = RES_100_1/10W_5%_0402: RES 100 OHM 1/10W 5% 0402 SMD; Manufacturer: Panasonic Electronic Components; Manufacturer Part Number: ERJ-2RKF1000X; Resistance (Ohms): 100; Power (Watts): 0.1W, 1/10W; Temperature Coefficient: ±100ppm/°C; Supplier 1: Digi-Key; Supplier Part Number 1: P100LDKR-ND; RoHS: RoHS Compliant; Category: Resistors; Stock 1: 2375521; Pricing 1: 1=0.1, 50=0.0242, 100=0.0184, 250=0.01364, 500=0.01008, 1000=0.00672, 5000=0.00473 (USD); Composition: Thick Film; Features: -; Tolerance: ±1%; Package / Case: 0402 (1005 Metric); Supplier Device Package: 0402; Size / Dimension: 0.039" L x 0.020" W (1.00mm x 0.50mm); Height: 0.016" (0.40mm); Number of Terminations: 2; Packaging: Digi-Reel®; ComponentLink1URL: http://industrial.panasonic.com/www-cgi/jvcr13pz.cgi?E+PZ+3+AOA0002+ERJ2RKF1000X+7+WW; ComponentLink1Description: http://industrial.panasonic.com/www-cgi/jvcr13pz.cgi?E+PZ+3+AOA0002+ERJ2RKF1000X+7+WW
R?#112 R?#115 = RES_470_1/10W_5%_0402: Manufacturer: Panasonic Electronic Components; Manufacturer Part Number: ERJ-2GEJ471X; Resistance (Ohms): 470; Power (Watts): 0.1W, 1/10W; Temperature Coefficient: ±200ppm/°C; Supplier 1: Digi-Key; RoHS: RoHS Compliant; Category: Resistors; Stock 1: 306353; Pricing 1: 1=0.1, 50=0.0172, 100=0.0131, 250=0.00976, 500=0.0072, 1000=0.0048, 5000=0.00338 (USD); Packaging: Cut Tape (CT); Tolerance: ±5%; Composition: Thick Film; Features: -; Package/Case: 0402 (1005 Metric); Supplier Device Package: 0402; Size / Dimension: 0.039" L x 0.020" W (1.00mm x 0.50mm); Height: 0.016" (0.40mm); Number of Terminations: 2; ComponentLink1URL: http://industrial.panasonic.com/www-cgi/jvcr13pz.cgi?E+PZ+3+AOA0001+ERJ2GEJ471X+7+WW; ComponentLink1Description: http://industrial.panasonic.com/www-cgi/jvcr13pz.cgi?E+PZ+3+AOA0001+ERJ2GEJ471X+7+WW; Supplier Part Number 1: P470JCT-ND
R?#116 = RES_0.1_0805: RES .10 OHM 1/8W 5% 0805; Manufacturer: CTS Resistor Products; Manufacturer Part Number: 73L3R10J; Resistance (Ohms): 0.1; Power (Watts): 0.125W, 1/8W; Temperature Coefficient: ±200ppm/°C; Supplier 1: Digi-Key; Supplier Part Number 1: 73L3R10JDKR-ND; RoHS: RoHS Compliant; Category: Resistors; Stock 1: 37057; Pricing 1: 1=0.1, 10=0.066, 100=0.0267, 250=0.0204, 500=0.01632, 1000=0.01201 (USD); Composition: Thick Film; Features: Current Sense; Tolerance: ±5%; Package / Case: 0805 (2012 Metric); Supplier Device Package: 0805; Size / Dimension: 0.079" L x 0.049" W (2.00mm x 1.25mm); Height: 0.026" (0.65mm); Number of Terminations: 2; Packaging: Digi-Reel®; ComponentLink1URL: http://www.ctscorp.com/components/Datasheets/008-0337-0.pdf; ComponentLink1Description: http://www.ctscorp.com/components/Datasheets/008-0337-0.pdf
R?#119 R?#122 R?#124 = RES_0_1/16W_1%_0402: RES 0.0 OHM 1/16W 0402 SMD; Manufacturer: Yageo; Manufacturer Part Number: RC0402JR-070RL; Power (Watts): 0.063W, 1/16W; Resistance (Ohms): 0.0; Tolerance: Jumper; Category: Resistors; ComponentLink1Description: http://www.yageo.com/documents/recent/PYu-RC0402_51_RoHS_L_6.pdf; ComponentLink1URL: http://www.yageo.com/documents/recent/PYu-RC0402_51_RoHS_L_6.pdf; Composition: Thick Film; Features: -; Height: 0.016" (0.40mm); Number of Terminations: 2; Package / Case: 0402 (1005 Metric); Packaging: Digi-Reel®; Pricing 1: 1=0.1, 10=0.012, 25=0.0092, 100=0.0055, 250=0.00476, 500=0.00336, 1000=0.00237, 2500=0.00206, 5000=0.00178 (USD); RoHS: RoHS Compliant; Size / Dimension: 0.039" L x 0.020" W (1.00mm x 0.50mm); Stock 1: 4904429; Supplier 1: Digi-Key; Supplier Device Package: 0402; Supplier Part Number 1: 311-0.0JRDKR-ND; Temperature Coefficient: -
R?#123 = RES_1M_1/16W_1%_0402: Resistor 1Mohm 1/16W 1% 0402; Manufacturer: Stackpole Electronics Inc; Manufacturer Part Number: RMCF0402FT1M00; Power (Watts): 0.063W, 1/16W; Temperature Coefficient: ±100ppm/°C; Supplier 1: Digi-Key; Supplier Part Number 1: RMCF0402FT1M00DKR-ND; RoHS: RoHS Compliant; Category: Resistors; Stock 1: 175650; Pricing 1: 1=0.04, 10=0.025, 50=0.0138, 100=0.0105, 250=0.0078, 500=0.00576, 1000=0.00384, 2500=0.00324, 5000=0.0027 (USD); Resistance (Ohms): 1M; Composition: Thick Film; Features: -; Tolerance: ±1%; Package / Case: 0402 (1005 Metric); Supplier Device Package: 0402; Size / Dimension: 0.039" L x 0.020" W (1.00mm x 0.50mm); Height: 0.016" (0.40mm); Number of Terminations: 2; Packaging: Digi-Reel®; ComponentLink1URL: http://www.seielect.com/Catalog/SEI-RMCF_RMCP.pdf; ComponentLink1Description: http://www.seielect.com/Catalog/SEI-RMCF_RMCP.pdf
R?#126 = RES_12.1K_1/16W_1%_0402: RES 12.1K OHM 1/16W 1% 0402 SMD; Manufacturer: Yageo; Manufacturer Part Number: RC0402FR-0712K1L; Power (Watts): 0.063W, 1/16W; Temperature Coefficient: ±100ppm/°C; Category: Resistors; ComponentLink1Description: http://www.yageo.com/documents/recent/PYu-RC0402_51_RoHS_L_6.pdf; ComponentLink1URL: http://www.yageo.com/documents/recent/PYu-RC0402_51_RoHS_L_6.pdf; Composition: Thick Film; Features: -; Height: 0.016" (0.40mm); Number of Terminations: 2; Package / Case: 0402 (1005 Metric); Packaging: Digi-Reel®; Pricing 1: 1=0.1, 10=0.014, 25=0.0104, 100=0.0063, 250=0.0054, 500=0.00382, 1000=0.0027, 2500=0.00234, 5000=0.00203 (USD); Resistance (Ohms): 12.1k; RoHS: RoHS Compliant; Size / Dimension: 0.039" L x 0.020" W (1.00mm x 0.50mm); Stock 1: 320170; Supplier 1: Digi-Key; Supplier Device Package: 0402; Supplier Part Number 1: 311-12.1KLRDKR-ND; Tolerance: ±1%
U?#18 = LAN8710 QFN32_1: Ethernet ICs 10/100 Ethernet XCVR w/HPAutoMDIX FlexPwr; PART#: SMSC LAN8710A-EZK; Manufacturer: Microchip Technology; Manufacturer Part Number: LAN8710A-EZK-TR; Data Rate: 125 Mb/s; Number of Transceivers: 1; Standard Supported: 802.3, 802.3u; Supply Voltage - Max: 3.6 V; Supply Voltage - Min: 1.6 V, 3 V; Supplier 1: Mouser; Supplier Part Number 1: 886-LAN8710A-EZK-TR; RoHS: RoHS Compliant; Category: Ethernet ICs; Stock 1: 12109; Pricing 1: 1=1.70, 10=1.47, 25=1.23, 100=1.11, 4000=1.11 (AUD); Package / Case: QFN-32; Packaging: Reel; Product: Ethernet Transceivers; Type: Single Chip; Mounting Style: SMD/SMT; Maximum Operating Temperature: + 85 C; Minimum Operating Temperature: 0 C; Product Category: Ethernet Controllers; RoHS - Mouser: Y; Minimum Order Quantity: 1; Reeling: True; ComponentLink1URL: http://media.digikey.com/pdf/Data%20Sheets/SMSC/LAN8710.pdf; ComponentLink1Description: http://media.digikey.com/pdf/Data%20Sheets/SMSC/LAN8710.pdf
Y?#4 = Suntsu ITEMP 25MHz _0.005% 20pf: Manufacturer: Abracon Corporation; Manufacturer Part Number: ABM3-25.000MHZ-B2-T; Frequency: 25MHz; Frequency Stability: ±50ppm; Frequency Tolerance: ±20ppm; Load Capacitance: 18pF; ESR (Equivalent Series Resistance): 50 Ohm; Operating Mode: Fundamental; Supplier 1: Digi-Key; Supplier Part Number 1: 535-9108-6-ND; RoHS: RoHS Compliant; Category: Crystals and Oscillators; Stock 1: 23589; Pricing 1: 1=1.43, 10=1.235, 50=1.083, 100=0.855, 500=0.722 (USD); Type: MHz Crystal; Operating Temperature: -20°C ~ 70°C; Ratings: -; Mounting Type: Surface Mount; Package / Case: 2-SMD; Size / Dimension: 0.197" L x 0.126" W (5.00mm x 3.20mm); Height: 0.051" (1.30mm); Packaging: Digi-Reel®; ComponentLink1URL: http://www.abracon.com/Resonators/abm3.pdf; ComponentLink1Description: http://www.abracon.com/Resonators/abm3.pdf